# EAGLE design eeZeeISP_Tiny_FT230X (EAGLE 6.4)
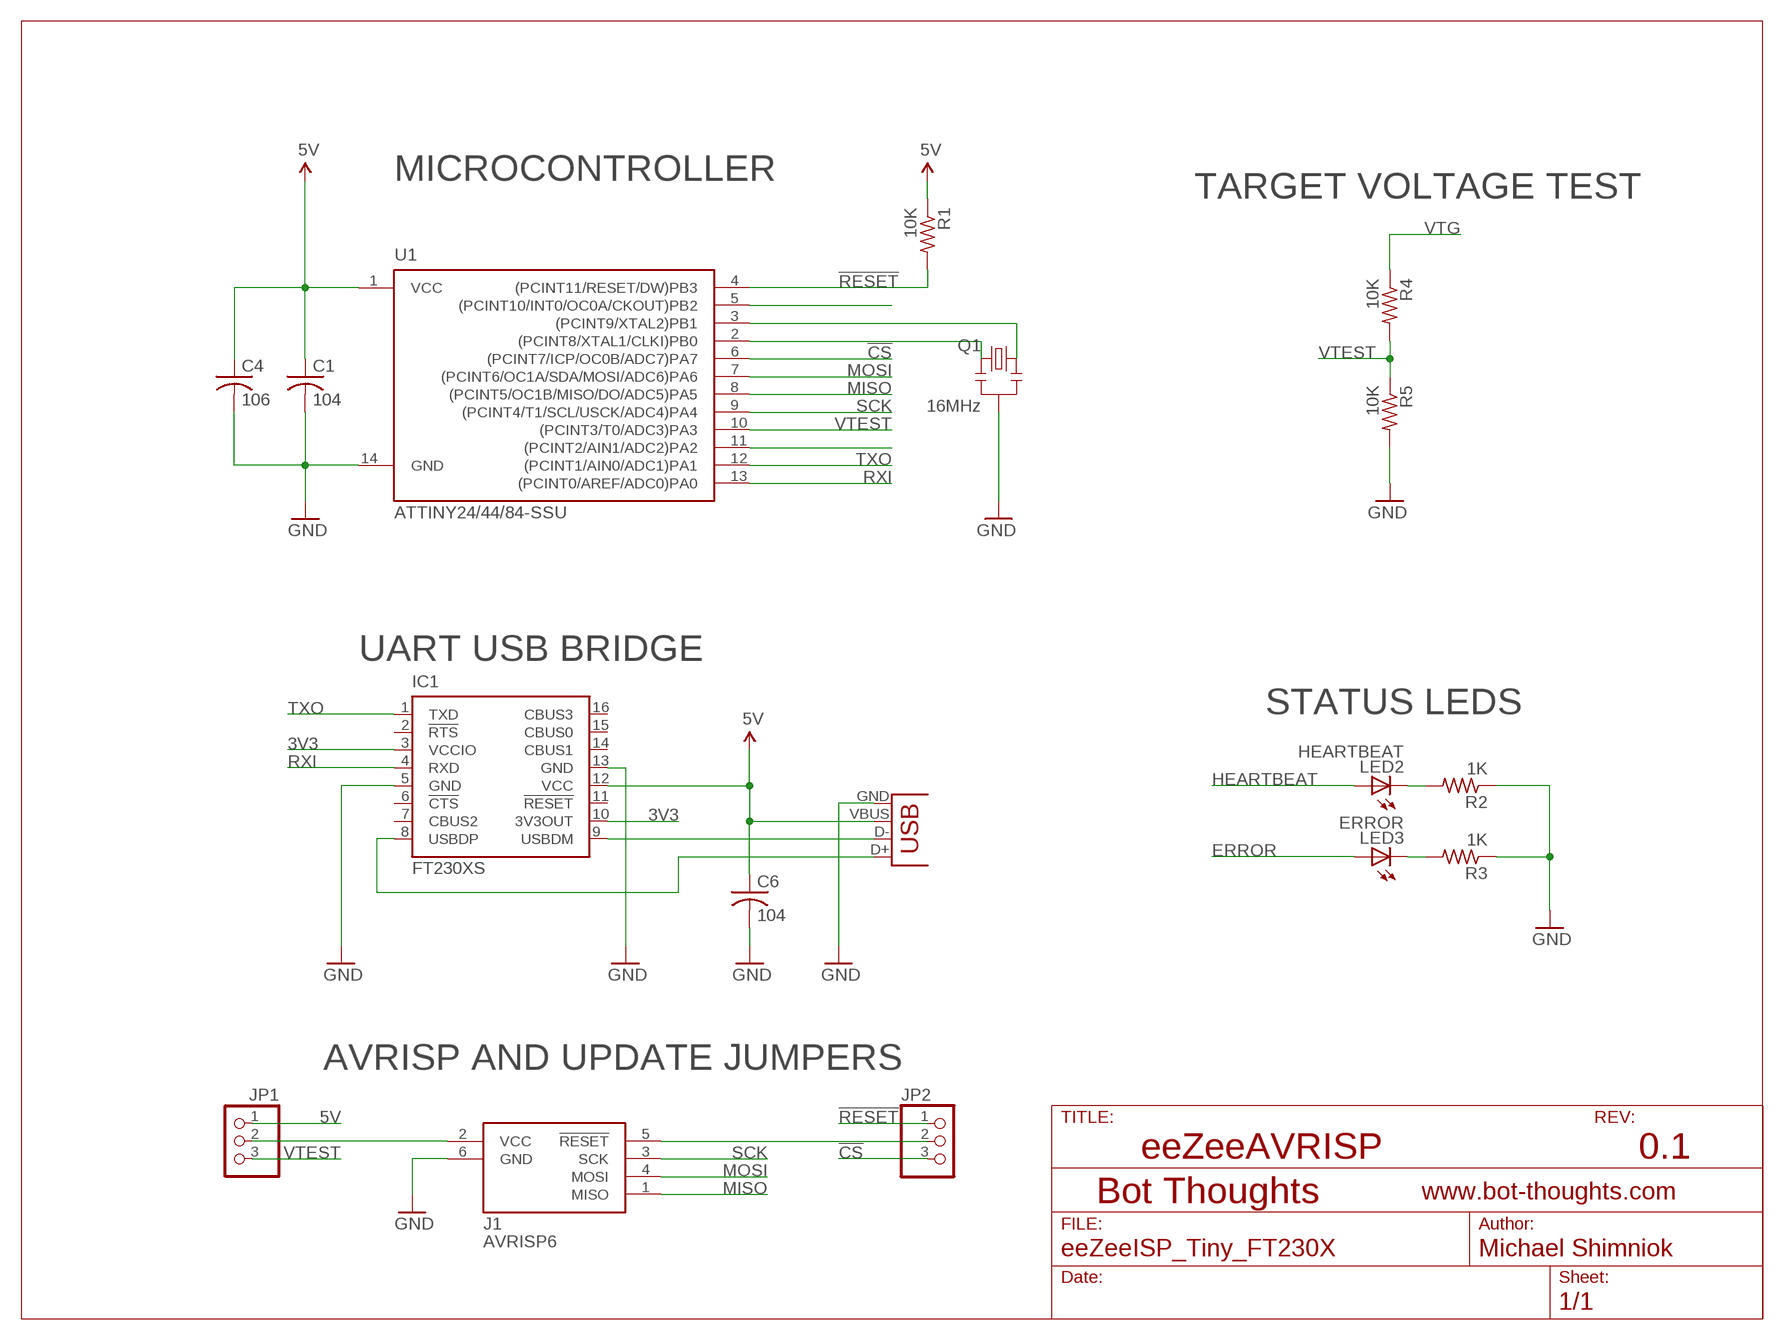
[diagram p0: schematic, sheet 1]

## Parts
C1  104  C-USC0603  [C0603]
C4  106  C-USC0603  [C0603]
C6  104  C-USC0603  [C0603]
IC1  FT230XS  [SSOP16]
J1  AVRISP6  [CON6P2R]
JP1  PINHD-1X03_2.00  [1X03M]
JP2  PINHD-1X03_2.00  [1X03M]
LED2  HEARTBEAT  LEDCHIPLED_1206  [CHIPLED_1206]
LED3  ERROR  LEDCHIPLED_1206  [CHIPLED_1206]
Q1  16MHz  RESONATOR_CSTCE_V_C  [CSTCE_V_C]
R1  10K  R-US_R0603  [R0603]
R2  1K  R-US_R0603  [R0603]
R3  1K  R-US_R0603  [R0603]
R4  10K  R-US_R0603  [R0603]
R5  10K  R-US_R0603  [R0603]
U1  ATTINY24/44/84-SSU  [SOIC14]
X2  USB-SMD-NS  [USB-MINIB-NOSTOP]

## Nets
3V3: IC1.3(VCCIO) IC1.10(3V3OUT)
5V: C1.1 C4.1 C6.1 IC1.12(VCC) JP1.1 R1.1 U1.1(VCC) X2.VBUS
!CS: JP2.3 U1.6((PCINT7/ICP/OC0B/ADC7)PA7)
!RESET: JP2.1 R1.2 U1.4((PCINT11/RESET/DW)PB3)
ERROR: LED3.A U1.11((PCINT2/AIN1/ADC2)PA2)
GND: C1.2 C4.2 C6.2 IC1.5(GND) IC1.13(GND) J1.6(GND) Q1.GND R2.1 R3.1 R5.2 U1.14(GND) X2.GND
HEARTBEAT: LED2.A U1.5((PCINT10/INT0/OC0A/CKOUT)PB2)
MISO: J1.1(MISO) U1.8((PCINT5/OC1B/MISO/DO/ADC5)PA5)
MOSI: J1.4(MOSI) U1.7((PCINT6/OC1A/SDA/MOSI/ADC6)PA6)
N$3: J1.2(VCC) JP1.2
N$4: J1.5(!RESET) JP2.2
N$8: Q1.X1 U1.3((PCINT9/XTAL2)PB1)
N$9: IC1.8(USBDP) X2.D+
N$10: LED2.C R2.2
N$11: LED3.C R3.2
N$13: Q1.X2 U1.2((PCINT8/XTAL1/CLKI)PB0)
N$15: IC1.9(USBDM) X2.D-
RXI: IC1.4(RXD) U1.13((PCINT0/AREF/ADC0)PA0)
SCK: J1.3(SCK) U1.9((PCINT4/T1/SCL/USCK/ADC4)PA4)
TXO: IC1.1(TXD) U1.12((PCINT1/AIN0/ADC1)PA1)
VTEST: JP1.3 R4.2 R5.1 U1.10((PCINT3/T0/ADC3)PA3)
VTG: R4.1
Unconnected: IC1.2(!RTS) IC1.6(!CTS) IC1.7(CBUS2) IC1.11(!RESET) IC1.14(CBUS1) IC1.15(CBUS0) IC1.16(CBUS3)

## Notes on the sheet
- MICROCONTROLLER
- TARGET VOLTAGE TEST
- UART USB BRIDGE
- STATUS LEDS
- AVRISP AND UPDATE JUMPERS
- eeZeeAVRISP | 0.1

## Library data of the parts
C1 C4 C6 = rcl:C-US: CAPACITOR, American symbol
IC1 = ftdichip:FT230X: USB to BASIC UART IC Auto generated by make-symbol-device-package-bsdl.ulp Rev. 43 Source: Data sheet <http://www.ftdichip.com/Support/Documents/DataSheets/ICs/DS_FT230X.pdf>
J1 = bt_avr:AVRISP6: 6-pin dual-row connector for Atmel AVRISP programmer interface
JP1 JP2 = pinhead-2:PINHD-1X03: PIN HEADER
LED2 LED3 = bt_opto:LED: LED Various packages
Q1 = bt_crystal:RESONATOR: Crystal Resonator, 3-pin
R1-R5 = rcl:R-US_: RESISTOR, American symbol
U1 = bt_avr:ATTINY24/44/84: Atmel AVR ATtiny24/44/84 14-pin High Performance, Low Power AVR® 8-bit Microcontroller
X2 = SparkFun:USB: USB Connectors USB-B-PTH is fully proven SKU : PRT-00139 USB-miniB is fully proven SKU : PRT-00587 USB-A-PCB is untested. USB-A-H is throughly reviewed, but untested. Spark Fun Electronics SKU : PRT-00437 USB-B-SMT is throughly reviewed, but untested. Needs silkscreen touching up. USB-A-S has not been used/tested USB-MB-H has not been used/tested

## Net classes
1 power: width 0.254 mm

## Board
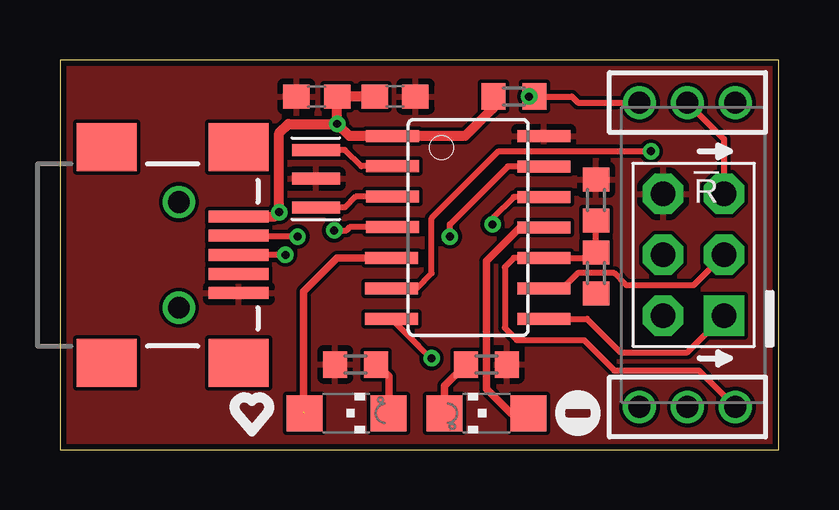
[diagram p1: board, top side]
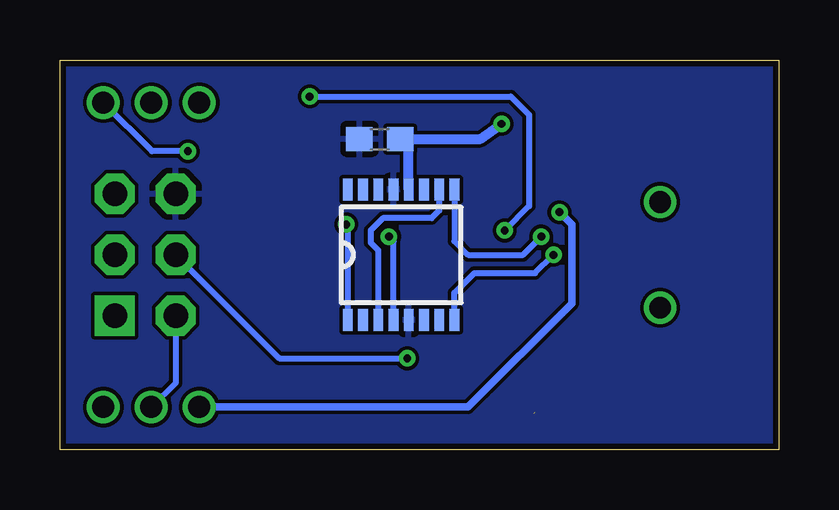
[diagram p2: board, bottom side, seen from below]

Size 29.97 x 16.26 mm. Coordinates in mm from the lower left corner, seen from the top.
Outline: 0,0 29.97,0 29.97,16.26 0,16.26 0,0
Copper layers (1*16): Top 0.0356mm / dielectric 1.5011mm / Bottom 0.0356mm
Design rules "LaenPCBOrder *": minimum track width 6mil, minimum drill 13mil, track to track 6mil, track to pad 6mil, pad to pad 6mil, via to via 6mil, smd to smd 6mil, copper to edge 10mil, drill to drill 6mil, minimum pad ring 7mil, minimum via ring 7mil, stop-mask expansion 4mil, vias tented up to drill 20mil, thermal gap 10mil

### Footprints (pad centres in the part's own frame; a part is rotated, then mirrored left to right if it is on the bottom)
C0603 = smd 1.1 x 1: 1 -0.85,0; 2 0.85,0
SSOP16 = smd 0.914 x 0.406: 1 -2.718,2.223; 2 -2.718,1.587; 3 -2.718,0.953; 4 -2.718,0.318; 5 -2.718,-0.318; 6 -2.718,-0.953; 7 -2.718,-1.587; 8 -2.718,-2.223; 9 2.718,-2.223; 10 2.718,-1.587; 11 2.718,-0.953; 12 2.718,-0.318; 13 2.718,0.318; 14 2.718,0.953; 15 2.718,1.587; 16 2.718,2.223
CON6P2R = drill 1.016 pad 1.676 square: 1 -2.54,-1.27 | drill 1.016 pad 1.676 octagon: 2 -2.54,1.27; 3 0,-1.27; 4 0,1.27; 5 2.54,-1.27; 6 2.54,1.27
1X03M = drill 0.914: 1 -2,0; 2 0,0; 3 2,0
CHIPLED_1206 = smd 1.5 x 1.5: A 0,-1.75; C 0,1.75
CSTCE_V_C = smd 0.5 x 2: GND 0,0; X1 -1.2,0; X2 1.2,0
R0603 = smd 1 x 1.1: 1 -0.85,0; 2 0.85,0
SOIC14 = smd 0.5 x 2.2: 1 -1.905,-3.154; 2 -0.645,-3.154; 3 0.625,-3.154; 4 1.895,-3.154; 5 3.175,-3.196; 6 4.445,-3.196; 7 5.715,-3.196; 8 5.715,3.154; 9 4.445,3.154; 10 3.175,3.154; 11 1.905,3.154; 12 0.635,3.154; 13 -0.635,3.154; 14 -1.905,3.154
USB-MINIB-NOSTOP = smd 2.5 x 0.5: D+ 2.5,0; D- 2.5,0.8; GND 2.5,-1.6; ID 2.5,-0.8; VBUS 2.5,1.6 | smd 2.5 x 2: G1 -3,-4.5; G2 -3,4.5; G3 2.5,4.5; G4 2.5,-4.5 | drill 0.9 pad 0.8: H1 0,2.2 | drill 0.9 pad 0.787: H2 0,-2.2

### Placement (x,y rotation side)
C1  13.97,14.73 0 top
C4  10.71,14.73 180 top
C6  16.64,12.95 180 bottom
IC1  15.75,8.13 90 bottom
J1  26.42,8.13 90 top
JP1  26.16,1.78 0 top
JP2  26.16,14.48 0 top
LED2  11.94,1.52 270 top
LED3  17.78,1.52 90 top
Q1  10.67,11.3 90 top
R1  18.92,14.73 0 top
R2  12.32,3.56 0 top
R3  17.78,3.56 180 top
R4  22.35,7.37 90 top
R5  22.35,10.41 90 top
U1  17.02,11.18 270 top
X2  4.95,8.13 0 top

### Tracks (layer width: path | path; a pad name or v marks a point on that pad's centre or on a via)
3V3
  Bottom 0.254: IC1.10 14.16,9.97 14.48,9.65 16.51,9.65 17.02,9.14 17.02,8.64 16.7,8.32 IC1.3
5V  (via drill 0.33)
  Top 0.406: C1.1 C4.1 v11.56,13.59 | X2.VBUS 8.97,9.73 v9.14,9.91 9.14,13.21 9.53,13.59 v11.56,13.59 | v11.56,13.59 12.06,13.08 U1.1 16.89,13.08 18.03,14.22 18.03,14.69 R1.1
  Bottom 0.305: JP1.1 12.95,1.78 8.64,6.1 8.64,9.4 v9.14,9.91
  Bottom 0.406: v11.56,13.59 12.45,12.95 C6.1 15.43,12.6 IC1.12
!CS  (via drill 0.33)
  Top 0.254: U1.6 14.86,6.73 15.49,7.37 15.49,9.65 18.29,12.45 v24.64,12.45
  Bottom 0.254: v24.64,12.45 26.13,12.45 JP2.3
!RESET  (via drill 0.33)
  Top 0.254: JP2.1 21.59,14.48 21.34,14.73 R1.2 v19.56,14.73 | v11.43,9.14 11.94,9.14 12.07,9.28 U1.4
  Bottom 0.254: v19.56,14.73 11.18,14.73 10.41,13.97 10.41,10.16 v11.43,9.14
ERROR
  Top 0.305: U1.11 19.18,9.27 17.78,7.87 17.78,2.54 18.8,1.52 LED3.A
GND
  pour Top: 0,16.26 29.97,16.26 29.97,0 0,0
  pour Bottom: 0,16.26 29.97,16.26 29.97,0 0,0
HEARTBEAT  (1 unrouted)
  Top 0.305: U1.5 11.56,8 10.16,6.6 10.16,1.55
MISO
  Top 0.254: U1.8 21.97,5.46 23.37,4.06 26.16,4.06 J1.1
MOSI  (via drill 0.33)
  Top 0.254: v15.49,3.81 14.96,4.32 U1.7
  Bottom 0.254: J1.4 20.83,3.81 v15.49,3.81
N$3
  Bottom 0.254: J1.2 25.15,2.79 JP1.2
N$4
  Top 0.254: JP2.2 27.69,12.95 J1.5
N$8
  Top 0.254: U1.3 12.33,10.55 11.88,10.1 Q1.X1
N$9  (via drill 0.33)
  Top 0.254: v9.4,8.13 X2.D+
  Bottom 0.254: IC1.8 13.53,6.54 12.7,7.37 10.16,7.37 v9.4,8.13
N$10
  Top 0.305: R2.2 13.21,3.56 13.72,3.05 13.72,1.55 LED2.C
N$11
  Top 0.305: LED3.C 16.03,2.66 R3.2
N$13
  Top 0.254: U1.2 12.56,11.82 11.88,12.5 Q1.X2
N$15  (via drill 0.33)
  Top 0.254: v9.91,8.89 7.49,8.89 X2.D-
  Bottom 0.254: IC1.9 13.53,8.7 12.95,8.13 10.67,8.13 v9.91,8.89
RXI  (via drill 0.33)
  Top 0.254: v16.26,8.89 16.26,9.4 18.67,11.81 U1.13
  Bottom 0.254: IC1.4 16.07,8.7 v16.26,8.89
SCK
  Top 0.254: J1.3 26.42,6.86 23.62,6.86 23.11,7.37 21.59,7.37 20.95,6.73 U1.9
TXO  (via drill 0.33)
  Top 0.254: U1.12 18.92,10.54 18.03,9.65 v18.03,9.4
  Bottom 0.254: IC1.1 17.97,9.34 v18.03,9.4
VTEST
  Top 0.254: R5.1 R4.2 22.14,8 U1.10 18.92,8 18.54,7.62 18.54,5.08 19.05,4.57 21.84,4.57 23.11,3.3 26.64,3.3 JP1.3

### Text on the board
tNames: !R
tsilk: 106 | 104 | 10K | 10K | !R | 10K | 1K | 1K
bsilk: 104